# EAGLE design TOBD_STM32 (EAGLE 9.4.2)
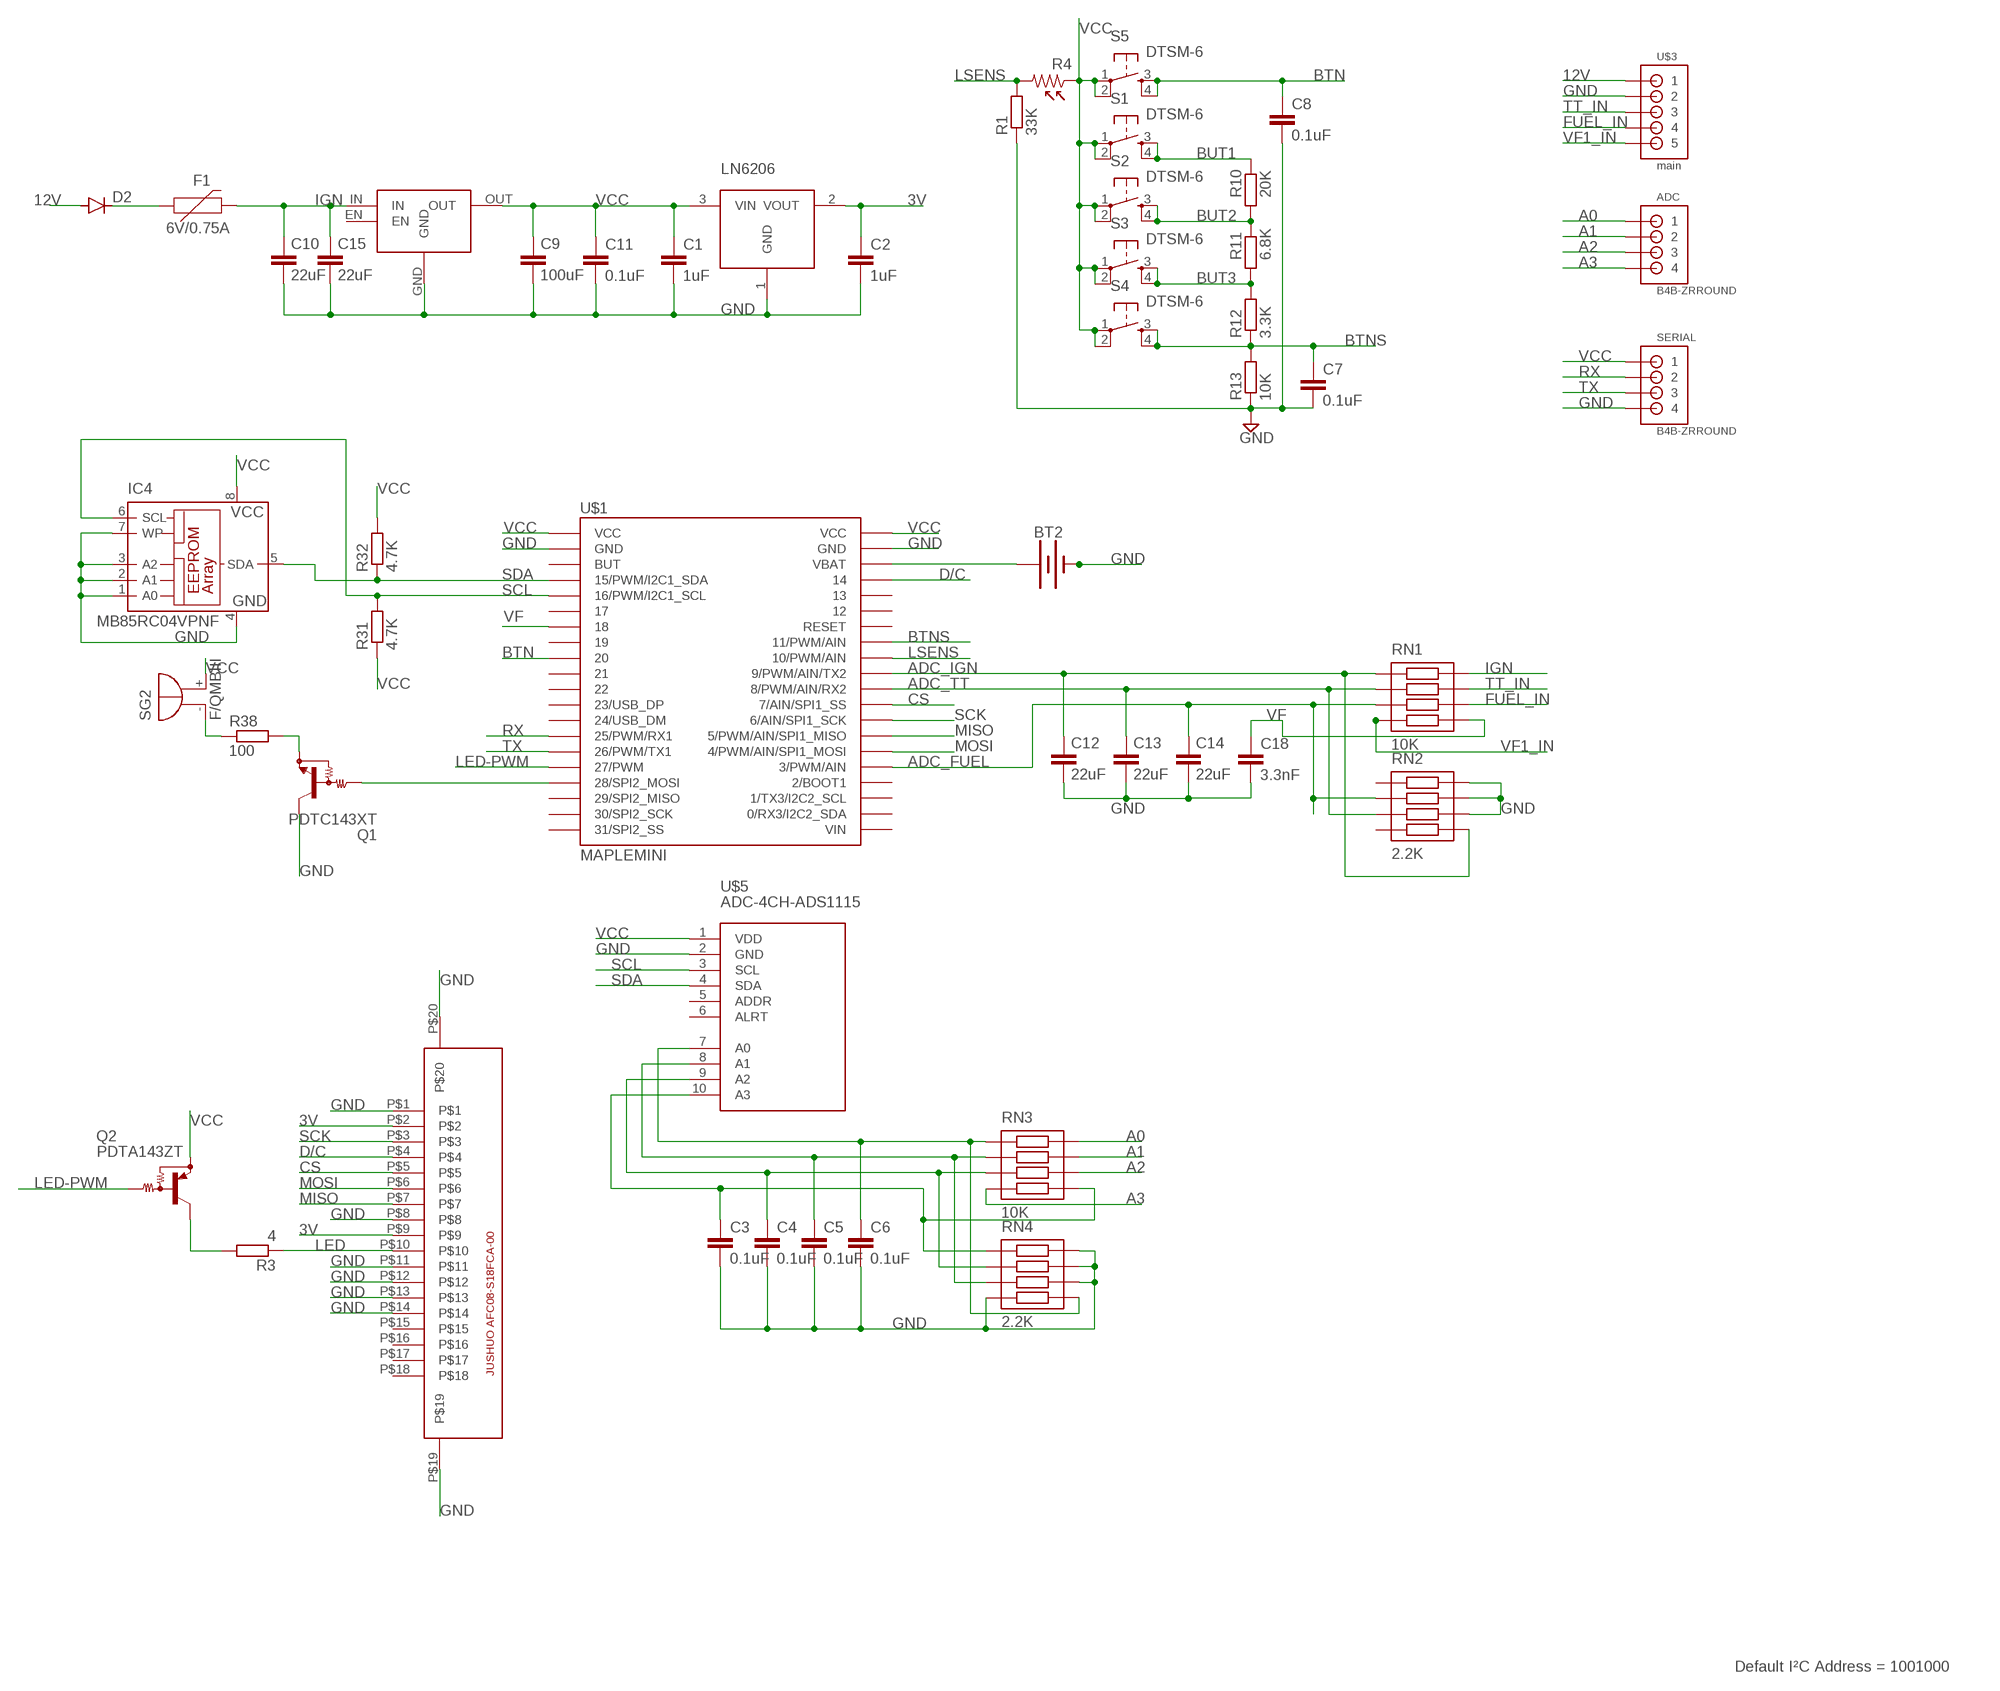
[diagram p0: schematic, sheet 1]

## Parts
ADC  B4B-ZRROUND  [B4B-ZR]
BT2  BATTERY  [BATTCOM_20MM_VERTICAL]
C1  1uF  C-EUC0805  [C0805]
C2  1uF  C-EUC0805  [C0805]
C3  0.1uF  C-EUC0805  [C0805]
C4  0.1uF  C-EUC0805  [C0805]
C5  0.1uF  C-EUC0805  [C0805]
C6  0.1uF  C-EUC0805  [C0805]
C7  0.1uF  C-EUC0805  [C0805]
C8  0.1uF  C-EUC0805  [C0805]
C9  100uF  C-EUC1210K  [C1210K]
C10  22uF  C-EUC0805  [C0805]
C11  0.1uF  C-EUC0805  [C0805]
C12  22uF  C-EUC0805  [C0805]
C13  22uF  C-EUC0805  [C0805]
C14  22uF  C-EUC0805  [C0805]
C15  22uF  C-EUC0805  [C0805]
C18  3.3nF  C-EUC0805  [C0805]
D2  DIODE-DO-214AC  [DO-214AC]
F1  6V/0.75A  PPTC_THREE-QUARTER-AMP  [1206]
IC4  MB85RC04VPNF  24C04ASN  [SO-08]
LN6206  MCP1700  [SOT23]
Q1  PDTC143XT  MUN2211T1  [SC59-BEC]
Q2  PDTA143ZT  MUN2111T1  [SC59-BEC]
R1  33K  R-EU_R0805  [R0805]
R3  4  R-EU_R0805  [R0805]
R4  PHOTORESPDV-P9  [PDV-P9XXX]
R10  20K  R-EU_R0805  [R0805]
R11  6.8K  R-EU_R0805  [R0805]
R12  3.3K  R-EU_R0805  [R0805]
R13  10K  R-EU_R0805  [R0805]
R31  4.7K  R-EU_R0805  [R0805]
R32  4.7K  R-EU_R0805  [R0805]
R38  100  R-EU_R0805  [R0805]
RN1  10K  RN2_EU-4  [CTS-744*083]
RN2  2.2K  RN2_EU-4  [CTS-744*083]
RN3  10K  RN2_EU-4  [CTS-744*083]
RN4  2.2K  RN2_EU-4  [CTS-744*083]
S1  DTSM-6  [DTSM-6]
S2  DTSM-6  [DTSM-6]
S3  DTSM-6  [DTSM-6]
S4  DTSM-6  [DTSM-6]
S5  DTSM-6  [DTSM-6]
SERIAL  B4B-ZRROUND  [B4B-ZR]
SG2  F/QMBIII  [F/QMBIII]
U$1  MAPLEMINI  [20-DIP]
U$2  JUSHUOAFC08-S18FCA-00  [JUSHUOAFC08-S18FCA-00]
U$3  main  B5B-ZRLONG  [B5B-ZR-LONG]
U$4  MINI-DC-DC-3AV  [MINI-DC-DC-3AV]
U$5  ADC-4CH-ADS1115  [ADC-4CH-ADS1115]

## Nets
3V: C2.1 LN6206.2(VOUT) U$2.P$2 U$2.P$9
12V: D2.A U$3.1
A0: ADC.1 RN3.5
A1: ADC.2 RN3.6
A2: ADC.3 RN3.7
A3: ADC.4 RN3.8
ADC_FUEL: C14.1 RN1.2 RN2.3 U$1.25(3/PWM/AIN)
ADC_IGN: C12.1 RN1.4 RN2.1 U$1.31(9/PWM/AIN/TX2)
ADC_TT: C13.1 RN1.3 RN2.2 U$1.30(8/PWM/AIN/RX2)
BTN: C8.1 S5.3 S5.4 U$1.9
BTNS: C7.1 R12.1 R13.2 S4.3 S4.4 U$1.33(11/PWM/AIN)
BUT1: R10.2 S1.3 S1.4
BUT2: R10.1 R11.2 S2.3 S2.4
BUT3: R11.1 R12.2 S3.3 S3.4
CS: U$1.29(7/AIN/SPI1_SS) U$2.P$5
D/C: U$1.37 U$2.P$4
FUEL_IN: RN1.7 U$3.4
GND: BT2.3(-) C1.2 C2.2 C3.2 C4.2 C5.2 C6.2 C7.2 C8.2 C9.2 C10.2 C11.2 C12.2 C13.2 C14.2 C15.2 C18.2 IC4.1(A0) IC4.2(A1) IC4.3(A2) IC4.4(GND) IC4.7(WP) LN6206.1(GND) Q1.C R1.1 R13.1 RN2.5 RN2.6 RN2.7 RN4.5 RN4.6 RN4.7 RN4.8 SERIAL.4 U$1.2(GND) U$1.39(GND) U$2.P$1 U$2.P$8 U$2.P$11 U$2.P$12 U$2.P$13 U$2.P$14 U$2.P$19 U$2.P$20 U$3.2 U$4.GND U$5.2(GND)
IGN: C10.1 C15.1 F1.2 RN1.5 U$4.IN
LED: R3.1 U$2.P$10
LED-PWM: Q2.B U$1.16(27/PWM)
LSENS: R1.2 R4.2 U$1.32(10/PWM/AIN)
MISO: U$1.27(5/PWM/AIN/SPI1_MISO) U$2.P$7
MOSI: U$1.26(4/PWM/AIN/SPI1_MOSI) U$2.P$6
N$1: R38.1 SG2.-(+)
N$2: Q2.C R3.2
N$3: D2.C F1.1
N$10: C6.1 RN3.4 RN4.1 U$5.7(A0)
N$11: C5.1 RN3.3 RN4.2 U$5.8(A1)
N$12: C4.1 RN3.2 RN4.3 U$5.9(A2)
N$13: C3.1 RN3.1 RN4.4 U$5.10(A3)
N$38: Q1.B U$1.17(28/SPI2_MOSI)
N$39: Q1.E R38.2
RX: SERIAL.2 U$1.14(25/PWM/RX1)
SCK: U$1.28(6/AIN/SPI1_SCK) U$2.P$3
SCL: IC4.6(SCL) R31.2 U$1.5(16/PWM/I2C1_SCL) U$5.3(SCL)
SDA: IC4.5(SDA) R32.1 U$1.4(15/PWM/I2C1_SDA) U$5.4(SDA)
TT_IN: RN1.6 U$3.3
TX: SERIAL.3 U$1.15(26/PWM/TX1)
VBAT1: BT2.1(+) BT2.2(+) U$1.38(VBAT)
VCC: C1.1 C9.1 C11.1 IC4.8(VCC) LN6206.3(VIN) Q2.E R4.1 R31.1 R32.2 S1.1 S1.2 S2.1 S2.2 S3.1 S3.2 S4.1 S4.2 S5.1 S5.2 SERIAL.1 SG2.+(-) U$1.1(VCC) U$1.40(VCC) U$4.OUT U$5.1(VDD)
VF: C18.1 RN1.1 U$1.7
VF1_IN: RN1.8 U$3.5
Unconnected: RN2.4 RN2.8 U$1.3(BUT) U$1.6 U$1.8 U$1.10 U$1.11 U$1.12(23/USB_DP) U$1.13(24/USB_DM) U$1.18(29/SPI2_MISO) U$1.19(30/SPI2_SCK) U$1.20(31/SPI2_SS) U$1.21(VIN) U$1.22(0/RX3/I2C2_SDA) U$1.23(1/TX3/I2C2_SCL) U$1.24(2/BOOT1) U$1.34(RESET) U$1.35 U$1.36 U$2.P$15 U$2.P$16 U$2.P$17 U$2.P$18 U$4.EN U$5.5(ADDR) U$5.6(ALRT)

## Notes on the sheet
- Default I²C Address = 1001000

## Library data of the parts
ADC SERIAL = jst:B4B-ZR: JST-ZH Connector 4 pol, 1.5mm pitch Package: B4B-ZR Source: http://www.jst-mfg.com/product/pdf/eng/eZH.pdf
BT2 = SparkFun-Batteries:BATTERY: Battery - Single Cell A variety of battery chemistries, sizes, and footprints. Device List: 20MM_PTH - Coin Cell Battery Holder - 20mm (PTH) <https://www.sparkfun.com/products/783> 6.8MM_PTH - Coin Cell Battery Holder - 6.8MM(SMD) <https://www.digikey.com/product-detail/en/seiko-instruments/MS621FE-FL11E/728-1057-ND/1889208?WT.srch=1&gclid=CNOQ5a6LzdQCFZS2wAodXCkE0g> 12MM_SMD - Coin Cell Battery Holder - 12mm (SMD) <https://www.sparkfun.com/products/10592> 12MM_PTH - Coin Cell Battery Holder - 12mm (PTH) <https://www.sparkfun.com/products/7948> 20MM_SMD - 20mm Coin Cell Battery Holder (SMD) (2 legs) Used on the Big Time Watch Kit <https://www.sparkfun.com/products/11734> 20MM_SMD_4LEGS - Coin Cell Battery Holder - 20mm (SMD) <https://www.sparkfun.com/products/11892> 20MM_SMD_4LEGS_OVERPASTE - Coin Cell Battery Holder - 20mm (SMD) <https://www.sparkfun.com/products/11892> (Over-paste on the legs) 24.5MM_PTH - Coin Cell Battery Holder - 24.5mm (PTH) <https://www.sparkfun.com/products/8863> 9V - 9V Battery Holder - PC Mount Used on the SparkFun SparkPunk Sound Kit <https://www.sparkfun.com/products/11177> and SparkFun SparkPunk Sequencer Kit <https://www.sparkfun.com/products/12707> 18650 - Battery Holder - 18650 (PTH) <https://www.sparkfun.com/products/13113> AA - Battery Holder - 1xAA (PTH) <https://www.sparkfun.com/products/7949> AAA - Battery Holder - 1xAAA (PTH) <https://www.sparkfun.com/products/12718> AA_KIT - Battery Holder - 1xAA (PTH) <https://www.sparkfun.com/products/7949> Special kit package - pads only have exposed copper on one side of the board. AAA_KIT - Battery Holder - 1xAAA (PTH) <https://www.sparkfun.com/products/12718> Special kit package - pads only have exposed copper on one side of the board.
C1 C2 = rcl:C-EU: CAPACITOR, European symbol; MF: Samsung Electro-Mechanics; MPN: CL21F105ZOFNNNE; SPICEPREFIX: C; URL: https://lcsc.com/product-detail/Multilayer-Ceramic-Capacitors-MLCC-SMD-SMT_SAMSUNG_CL21F105ZOFNNNE_1uF-105-80-20-16V_C16834.html
C3-C8 C11 = rcl:C-EU: CAPACITOR, European symbol; MF: Samsung Electro-Mechanics; MPN: CL21F104ZBCNNNC; SPICEPREFIX: C; URL: https://lcsc.com/product-detail/Multilayer-Ceramic-Capacitors-MLCC-SMD-SMT_SAMSUNG_CL21F104ZBCNNNC_100nF-104-80-20-50V_C1760.html
C9 = resistor:C-EU: CAPACITOR, European symbol; LCSC: C88154; MF: Murata Electronics; MPN: GRM32ER60J107ME20L; URL: https://lcsc.com/product-detail/Multilayer-Ceramic-Capacitors-MLCC-SMD-SMT_muRata_GRM32ER60J107ME20L_100uF-107-20-6-3V_C88154.html
C10 C12-C15 = resistor:C-EU: CAPACITOR, European symbol; LCSC: C45783; MF: Samsung Electro-Mechanics; MPN: CL21A226MAQNNNE; URL: https://lcsc.com/product-detail/Multilayer-Ceramic-Capacitors-MLCC-SMD-SMT_Samsung-Electro-Mechanics-CL21A226MAQNNNE_C45783.html
C18 = rcl:C-EU: CAPACITOR, European symbol; MPN: CL21B332KBANNNC; SPICEPREFIX: C
D2 = diode:DIODE-: DIODE
F1 = SparkFun-Fuses:PPTC: Resettable Fuse PPTC Resettable Fuse. Really a sort of resistor with a polymeric positive temperature coefficient whose resistance increases dramatically with an increase in temperature. When heated by the power passing through the resistance rises causing the current to be limited, protecting the circuit. This is achieved by the transition of the polymer from a crystalline to an amorphous state where the conductive carbon separates breaking the conductive pathways found in the cool crystalline structure. When a PPTC cools back down it resumes conducting letting the circuit turn back on. SparkFun Products: SparkFun RedBoard - Programmed with Arduino <https://www.sparkfun.com/products/12757> Pro Micro - 5V/16MHz <https://www.sparkfun.com/products/12640> Arduino Pro 328 - 5V/16MHz <https://www.sparkfun.com/products/10915> MP3 Trigger <https://www.sparkfun.com/products/13720>; PROD_ID: RES-11150
IC4 = microchip:24C*: Serial EEPROM 1 K/2 K/4 K; OC_FARNELL: unknown; OC_NEWARK: unknown
LN6206 = borkedlabs-powerics:MCP1700; MPN: LN6206P302MR-G
Q1 = transistor-npn:MUN2211*: NPN Bias Resistor Transistor
Q2 = transistor-pnp:MUN2111*: PNP Bias Resistor Transistor
R1 R3 R10-R13 R31 R32 R38 = resistor:R-EU_: RESISTOR, European symbol
R4 = my_mixed:PHOTORES: Photoresistor
RN1-RN4 = m-pad-2.1:RN2_EU: Chip Resistor Array's from various manufactures; MPN: CRA064RJ10K0E04Z
S1-S5 = switch-tact:DTSM-6
SG2 = buzzer:F/QMBIII: BUZZER Source: Buerklin; OC_FARNELL: unknown; OC_NEWARK: unknown
U$1 = maplemini:MAPLEMINI
U$2 = my:JUSHUOAFC08-S18FCA-00; MPN: AFC08-S18FCA-00
U$3 = jst:B5B-ZR: JST-ZH Connector 5 pol, 1.5mm pitch Package: B5B-ZR Source: http://www.jst-mfg.com/product/pdf/eng/eZH.pdf
U$4 = my:MINI-DC-DC-3A
U$5 = diy-modules:ADC-4CH-ADS1115: 4 Channel 16-Bit Analog-to-Digital Converter based on ADS1115 chip Arduino ADS1115 Getting Started Tutorial is available here: http://henrysbench.capnfatz.com/henrys-bench/arduino-voltage-measurements/arduino-ads1115-module-getting-started-tutorial/ ADS1115 datasheet is available here: http://www.ti.com/lit/ds/symlink/ads1115.pdf Click here to find device on ebay.com <http://www.ebay.com/sch/ads1115+module>

## Board
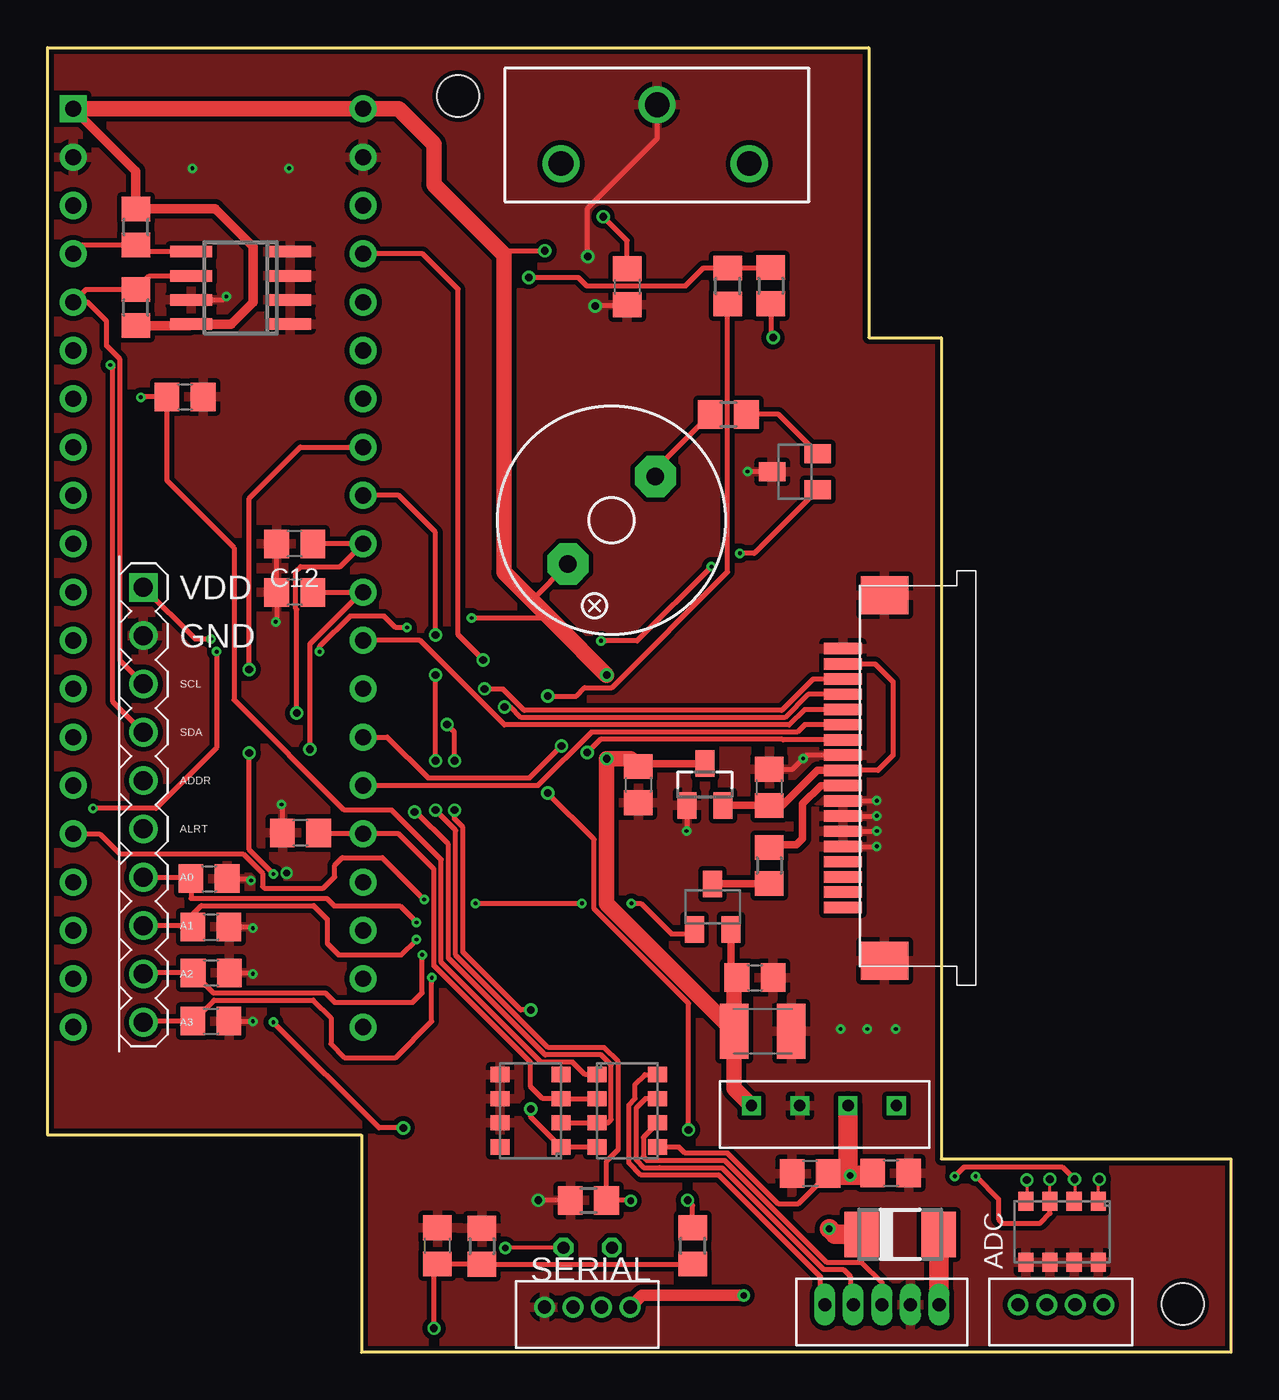
[diagram p1: board, top side]
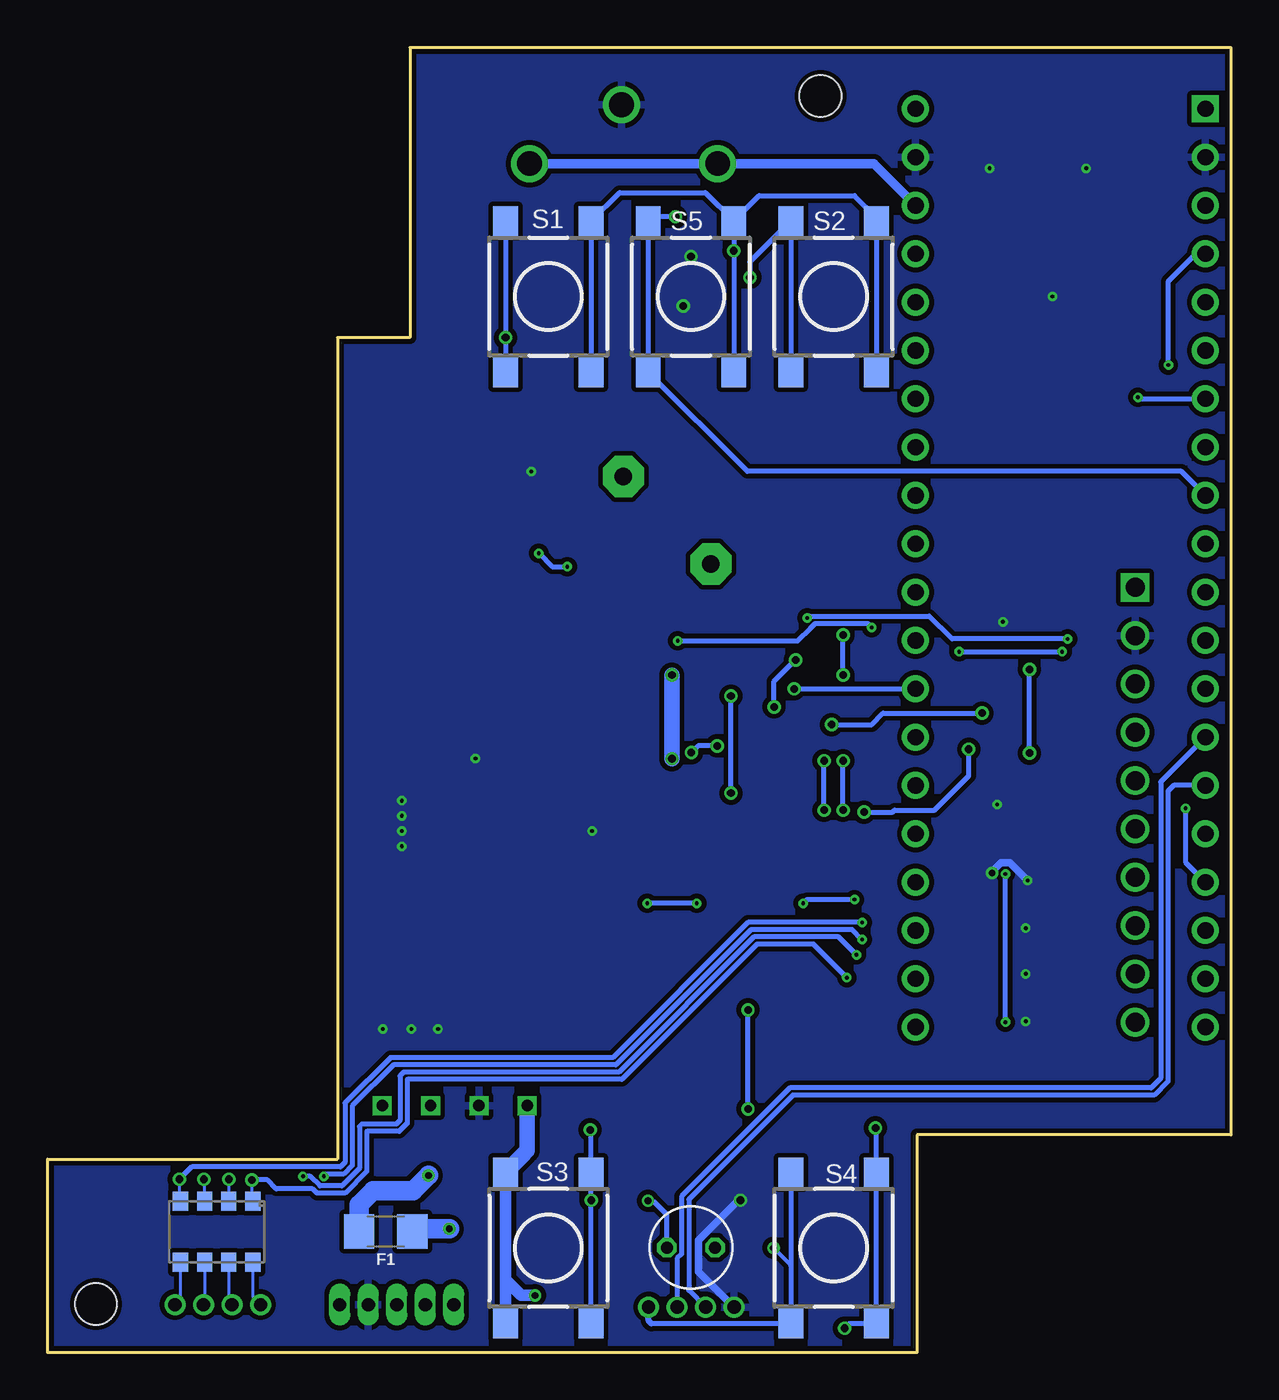
[diagram p2: board, bottom side, seen from below]

Size 62.23 x 68.58 mm. Coordinates in mm from the lower left corner, seen from the top.
Outline: 43.18,68.58 43.18,53.34 46.99,53.34 46.99,10.16 62.23,10.16 62.23,0 16.51,0 16.51,11.43 0,11.43 0,68.58 43.18,68.58
Copper layers (1*16): Top 0.035mm / dielectric 1.5mm / Bottom 0.035mm
Design rules "jlcpcb": minimum track width 5mil, minimum drill 0.2mm, track to track 5mil, track to pad 5mil, pad to pad 5mil, via to via 5mil, smd to smd 5mil, copper to edge 0.2mm, drill to drill 6mil, minimum pad ring 0.2mm, minimum via ring 0.15mm, stop-mask expansion 4mil, vias tented up to drill 0mil, thermal gap 10mil
Holes 2.2 mm at 21.59,66.04 59.69,2.54

### Footprints (pad centres in the part's own frame; a part is rotated, then mirrored left to right if it is on the bottom)
B4B-ZR = drill 0.7: 1 6,-1.3; 2 4.5,-1.3; 3 3,-1.3; 4 1.5,-1.3
BATTCOM_20MM_VERTICAL = drill 1.3: 1 4.85,-2; 2 -5.04,-2; 3 0.01,1.1
C0805 = smd 1.3 x 1.5: 1 -0.95,0; 2 0.95,0
C1210K = smd 1.5 x 2.9: 1 -1.5,0; 2 1.5,0
DO-214AC = smd 1.8 x 2.4: A 2.025,0; C -2.025,0
1206 = smd 1.6 x 1.8: 1 -1.4,0; 2 1.4,0
SO-08 = smd 0.6 x 2.2: 1 -1.905,-2.6; 2 -0.635,-2.6; 3 0.635,-2.6; 4 1.905,-2.6; 5 1.905,2.6; 6 0.635,2.6; 7 -0.635,2.6; 8 -1.905,2.6
SOT23 = smd 1 x 1.4: 1 -0.95,-1.1; 2 0.95,-1.1; 3 0,1.1
SC59-BEC = smd 1 x 1.4: B -0.95,-1.2; C 0,1.2; E 0.95,-1.2
R0805 = smd 1.3 x 1.5: 1 -0.95,0; 2 0.95,0
PDV-P9XXX = drill 0.635 octagon: 1 -1.27,0; 2 1.27,0
CTS-744*083 = smd 0.8 x 1: 1 -1.905,-1.6; 2 -0.635,-1.6; 3 0.635,-1.6; 4 1.905,-1.6; 5 1.905,1.6; 6 0.635,1.6; 7 -0.635,1.6; 8 -1.905,1.6
DTSM-6 = smd 1.55 x 1.3: 1 -3.975,2.25; 2 3.975,2.25; 3 -3.975,-2.25; 4 3.975,-2.25
F/QMBIII = drill 0.914 pad 2.159 octagon: + 3.251,0; - -3.251,0
20-DIP = drill 0.85 pad 1.422 square: 1 -24.13,-7.62 | drill 0.85 pad 1.422: 2 -21.59,-7.62; 3 -19.05,-7.62; 4 -16.51,-7.62; 5 -13.97,-7.62; 6 -11.43,-7.62; 7 -8.89,-7.62; 8 -6.35,-7.62; 9 -3.81,-7.62; 10 -1.27,-7.62; 11 1.27,-7.62; 12 3.81,-7.62; 13 6.35,-7.62; 14 8.89,-7.62; 15 11.43,-7.62; 16 13.97,-7.62; 17 16.51,-7.62; 18 19.05,-7.62; 19 21.59,-7.62; 20 24.13,-7.62; 21 24.13,7.62; 22 21.59,7.62; 23 19.05,7.62; 24 16.51,7.62; 25 13.97,7.62; 26 11.43,7.62; 27 8.89,7.62; 28 6.35,7.62; 29 3.81,7.62; 30 1.27,7.62; 31 -1.27,7.62; 32 -3.81,7.62; 33 -6.35,7.62; 34 -8.89,7.62; 35 -11.43,7.62; 36 -13.97,7.62; 37 -16.51,7.62; 38 -19.05,7.62; 39 -21.59,7.62; 40 -24.13,7.62
JUSHUOAFC08-S18FCA-00 = smd 0.6 x 2: P$1 0.3,1; P$2 1.1,1; P$3 1.9,1; P$4 2.7,1; P$5 3.5,1; P$6 4.3,1; P$7 5.1,1; P$8 5.9,1; P$9 6.7,1; P$10 7.5,1; P$11 8.3,1; P$12 9.1,1; P$13 9.9,1; P$14 10.7,1; P$15 11.5,1; P$16 12.3,1; P$17 13.1,1; P$18 13.9,1 | smd 2 x 2.5: P$19 -2.5,3.2; P$20 16.7,3.2
B5B-ZR-LONG = drill 0.7 long: 1 7.5,-1.3; 2 6,-1.3; 3 4.5,-1.3; 4 3,-1.3; 5 1.5,-1.3
MINI-DC-DC-3AV = drill 0.6 square: EN 1.27,9.271; GND 1.27,4.191; IN 1.27,6.731; OUT 1.27,1.651
ADC-4CH-ADS1115 = drill 1 square: 1 1.27,24.384 | drill 1: 2 1.27,21.844; 3 1.27,19.304; 4 1.27,16.764; 5 1.27,14.224; 6 1.27,11.684; 7 1.27,9.144; 8 1.27,6.604; 9 1.27,4.064; 10 1.27,1.524

### Placement (x,y rotation side)
ADC  49.53,3.81 0 top
BT2  32.04,64.48 0 top
C1  31.06,29.84 270 top
C2  37.95,29.7 90 top
C3  8.59,17.41 0 top
C4  8.61,19.95 0 top
C5  8.59,22.36 0 top
C6  8.49,24.9 0 top
C7  20.5,5.6 90 top
C8  30.47,56.01 270 top
C9  37.6,16.88 0 top
C10  40.1,9.4 180 top
C11  37.2,19.7 0 top
C12  13,42.5 180 top
C13  13,39.95 180 top
C14  13.3,27.3 180 top
C15  44.33,9.43 0 top
C18  7.23,50.22 0 top
D2  44.83,6.2 0 top
F1  44.45,6.35 180 bottom
IC4  10.15,55.95 90 top
LN6206  34.56,29.85 0 top
Q1  39.3,46.29 90 top
Q2  34.97,23.42 0 top
R1  28.44,7.99 0 top
R3  37.95,25.59 270 top
R4  28.4,5.51 180 bottom
R10  38.03,56.07 270 top
R11  35.76,56.05 90 top
R12  33.92,5.6 90 top
R13  22.84,5.58 270 top
R31  4.64,54.92 90 top
R32  4.64,59.15 90 top
R38  35.79,49.3 0 top
RN1  30.48,12.7 270 top
RN2  25.4,12.7 90 top
RN3  53.34,6.35 180 bottom
RN4  53.34,6.35 180 top
S1  35.9,55.49 270 bottom
S2  20.9,55.49 270 bottom
S3  35.9,5.49 90 bottom
S4  20.9,5.49 90 bottom
S5  28.4,55.49 270 bottom
SERIAL  24.63,3.68 0 top
SG2  29.66,43.74 225 top
U$1  8.97,41.23 270 top
U$2  40.81,37.29 270 top
U$3  39.37,3.81 0 top
U$4  35.36,14.24 270 top
U$5  3.77,15.83 0 top

### Tracks (layer width: path | path; a pad name or v marks a point on that pad's centre or on a via)
3V
  Top 0.254: U$2.P$2 43.51,36.19 44.45,35.25 44.45,31.38 43.66,30.59 U$2.P$9
  Top 0.406: U$2.P$9 40.47,30.59 38.63,28.75 C2.1 LN6206.2
12V
  Top 1.016: U$3.1 46.87,6.18 D2.A
A0
  Bottom 0.152: RN3.5 55.24,2.79 ADC.1
A1
  Bottom 0.152: RN3.6 53.98,2.56 ADC.2
A2
  Bottom 0.152: RN3.7 52.7,2.69 ADC.3
A3
  Bottom 0.152: RN3.8 51.44,2.92 ADC.4
ADC_FUEL
  Top 0.254: C14.1 14.29,27.26 U$1.25 18.46,27.26 20.32,25.4 20.32,20.32 25.4,15.24 25.4,13.97 26.04,13.34 RN2.3 RN1.2
ADC_IGN  (via drill 0.4)
  Top 0.254: RN1.4 RN2.1 25.4,12.39 v25.4,12.8 | C12.1 U$1.31 15.39,41.3 13.3,41.3 13.05,41.05 13.05,39.09 13.1,39.04 v13.1,33.6 | v25.4,18 24.88,18 21.84,21.03 21.84,27.59 21.4,28.04 v21.4,28.5 | v21.4,31.1 21.4,32.6 v21,33
  Bottom 0.254: v25.4,12.8 v25.4,18 | v21.4,28.5 v21.4,31.1 | v21,33 18.9,33 18.3,33.6 v13.1,33.6
ADC_TT  (via drill 0.4)
  Top 0.254: RN2.2 RN1.3 29.46,12.06 29.63,12.23 29.63,15.11 29.1,15.64 26.16,15.64 21.08,20.72 21.08,26.7 19.38,28.4 v19.3,28.4 | C13.1 16.51,39.95 | 16.51,39.95 U$1.30 | v13.8,31.7 13.8,37.24 16.51,39.95
  Bottom 0.254: v19.3,28.4 17.8,28.4 17.7,28.5 15.6,28.5 13.8,30.3 v13.8,31.7
BTN  (via drill 0.4)
  Top 0.254: C8.1 30.47,58.43 v29.21,59.69
  Bottom 0.254: v29.21,59.69 30.43,59.69 S5.3 S5.4 25.43,46.3 2.61,46.3 U$1.9
BTNS  (via drill 0.2, 0.4)
  Top 0.254: v20.32,1.27 20.32,4.47 C7.1 22.82,4.65 R13.2 33.9,4.63 R12.1 | v18.7,11.8 17.43,11.8 v11.87,17.36 | v10.6,35.9 10.6,44.89 13.29,47.58 U$1.33 | v11.87,25.15 10.6,26.42 v10.6,31.5
  Bottom 0.254: v20.32,1.27 20.07,1.51 S4.3 S4.4 18.65,11.75 v18.7,11.8 | v10.6,31.5 v10.6,35.9 | v11.87,17.36 v11.87,25.15
BUT1  (via drill 0.4)
  Top 0.254: R10.2 38.03,53.46 v38.15,53.34
  Bottom 0.254: S1.3 v38.15,53.34 S1.4
BUT2  (via drill 0.4)
  Top 0.254: R10.1 38.01,57 R11.2 34.49,57 33.55,56.06 28.34,56.06 27.9,56.5 v25.3,56.5
  Bottom 0.254: S2.4 S2.3 25.3,57.31 v25.3,56.5
BUT3  (via drill 0.4)
  Top 0.254: R12.2 33.92,7.73 v33.65,8 | v26.3,29.4 28.74,26.96 28.74,23.31 33.7,18.35 v33.7,11.7 | v26.3,34.5 27.8,34.5 28.24,34.94 29.67,34.94 35.76,41.03 R11.1
  Bottom 0.254: S3.3 v33.65,8 S3.4 33.65,11.65 v33.7,11.7 | v26.3,29.4 v26.3,34.5
CS
  Top 0.254: U$2.P$5 39.81,33.79 39,32.98 24.02,32.98 19.58,37.42 U$1.29
D/C  (via drill 0.4)
  Top 0.254: U$2.P$4 39.99,34.59 38.76,33.36 24.91,33.36 24.34,33.93 v24.03,33.93 | v22.9,36.4 21.59,37.71 21.59,55.88 19.73,57.74 U$1.37
  Bottom 0.254: v24.03,33.93 24.03,35.27 v22.9,36.4
FUEL_IN
  Top 0.254: U$3.4 42.2,2.68 42.2,4 41.84,4.37 40.8,4.37 35.46,9.7 32.2,9.7 32.18,9.72 31.34,9.72 30.95,10.12 30.95,12.85 31.43,13.34 RN1.7
GND  (via drill 0.2, 0.35, 0.4)
  Top 0.254: R1.1 v25.81,7.99 v25.8,8 | C8.2 30.41,55 v28.8,55 | BT2.3 32.05,63.79 28.4,60.14 v28.4,57.6 | v12,38.4 12.05,38.45 C13.2 C12.2 | C14.2 12.35,28.75 v12.3,28.8 | LN6206.1 v33.61,27.41 v33.6,27.4 | C2.2 39.16,30.65 v39.73,31.22 39.9,31.39 U$2.P$8 | C6.2 10.6,24.9 v10.7,24.8 | C5.2 10.74,22.36 v10.8,22.3 | C4.2 10.75,19.95 v10.8,19.9 | C3.2 v10.79,17.41 v10.8,17.4 | IC4.7 9.21,55.31 v9.4,55.5 | U$2.P$11 v43.59,28.99 v43.6,29 | U$2.P$12 v43.6,28.19 v43.6,28.2 | U$2.P$13 v43.59,27.39 v43.6,27.4 | U$2.P$14 v43.59,26.59 v43.6,26.6 | Q1.C v36.81,46.29 v36.8,46.3
  Bottom 0.406: SERIAL.4 27.99,4.24 27.99,5.9 25.89,8 v25.8,8 | 11.29,25.39 11.63,25.73 12.11,25.73 12.45,25.39 12.45,25.32 v12.57,25.2 | 11.29,25.39 | v10.7,24.8 11.29,25.39
  other vias: 41.7,17 43.1,17 44.6,17 7.62,62.23 12.7,62.23
  pour Bottom (isolate 0.254): -2.54,69.85 63.5,69.85 63.5,-2.54 -2.54,-2.54
  pour Top (isolate 0.254): -2.54,69.85 63.5,69.85 63.5,-5.08 -2.54,-5.08
IGN  (via drill 0.35)
  Top 0.254: C10.1 39.45,7.8 38.44,7.8 35.76,10.48 33.52,10.48 33.2,10.79 RN1.5
  Top 1.016: 43.18,9.23 C15.1 43.25,9.3 v42.2,9.3 41.81,9.3 41.91,9.4 | C10.1 41.91,9.4 | U$4.IN 42.09,9.58 41.91,9.4
  Bottom 1.016: F1.2 45.85,7.75 45.1,8.5 43,8.5 v42.2,9.3
LED
  Top 0.406: U$2.P$10 40.66,29.79 39.7,28.83 39.7,27 39.37,26.67 38.08,26.67 R3.1
LED-PWM  (via drill 0.2)
  Top 0.254: U$1.16 2.74,27.26 3.8,26.2 10.28,26.2 11.3,25.18 11.3,24.5 11.4,24.4 14.5,24.4 15.1,25 15.1,25.6 15.5,26 17.6,26 v19.8,23.8 | v22.5,23.6 v28.1,23.6 | v30.7,23.6 31.2,23.6 32.8,22 33.8,22 Q2.B
  Bottom 0.254: v19.8,23.8 22.3,23.8 v22.5,23.6 | v28.1,23.6 v30.7,23.6
LSENS  (via drill 0.35, 0.4)
  Top 0.254: v30.66,7.97 30.65,7.99 R1.2 29.39,10.05 30.02,10.67 30.02,15.27 29.26,16.02 26.32,16.02 21.46,20.88 21.46,27.44 v20.4,28.5 | v20.4,31.1 v20.4,35.6 | v20.4,37.7 20.4,43.1 18.46,45.04 U$1.32
  Bottom 0.254: v30.66,7.97 30.4,7.97 29.67,7.24 R4.2 | v20.4,28.5 v20.4,31.1 | v20.4,35.6 v20.4,37.7
MISO  (via drill 0.4)
  Top 0.254: U$1.27 17.86,32.34 20,30.2 25.35,30.2 v27.02,31.88 | v28.38,31.52 29.07,32.22 38.64,32.22 38.67,32.19 U$2.P$7
  Bottom 0.254: v27.02,31.88 28.02,31.88 v28.38,31.52
MOSI
  Top 0.254: U$1.26 25.8,29.8 28.6,32.6 39.42,32.6 39.81,32.99 U$2.P$6
N$1
  Top 0.254: R38.1 31.95,46.41 SG2.-
N$2
  Top 0.406: Q2.C 34.99,24.64 R3.2
N$3  (via drill 0.35)
  Top 1.016: D2.C 41.4,6.2 v41.1,6.5
  Bottom 1.016: v41.1,6.5 42.9,6.5 F1.1
N$10  (via drill 0.2, 0.4)
  Top 0.152: RN4.1 55.24,9.04 v55.3,9.1
  Top 0.254: U$5.7 7.47,24.97 C6.1 7.54,23.86 14.68,23.86 15.07,23.47 18.53,23.47 v19.4,22.6
  Bottom 0.152: v55.3,9.1 55.3,8.01 RN4.1
  Bottom 0.254: v19.4,22.6 25.4,22.6 32.5,15.5 44.2,15.5 46.59,13.11 46.59,9.99 46.82,9.76 54.64,9.76 v55.3,9.1
N$11  (via drill 0.2, 0.4)
  Top 0.152: v54,9.1 54,7.97 RN4.2
  Top 0.254: U$5.8 7.57,22.43 C5.1 7.64,23.04 8.08,23.48 14,23.48 14.7,22.78 14.7,21.5 15.3,20.9 18.6,20.9 v19.4,21.7 | v47.7,9.25 48.2,9.76 53.34,9.76 v54,9.1
  Bottom 0.152: RN4.2 53.98,9.07 v54,9.1
  Bottom 0.254: v19.4,21.7 19.92,22.22 25.24,22.22 32.34,15.12 44.04,15.12 46.21,12.96 46.21,9.84 46.66,9.38 47.58,9.38 v47.7,9.25
N$12  (via drill 0.2, 0.4)
  Top 0.152: RN4.3 52.7,8.89 52.7,8.9 v52.7,9.1
  Top 0.254: U$5.9 5.1,19.95 C4.1 8.71,18.9 14.6,18.9 15.1,18.4 19.2,18.4 19.7,18.9 v19.7,20.9 | v48.8,9.25 50,8.05 50,7 50.2,6.8 52.2,6.8 52.7,7.3 RN4.3
  Bottom 0.152: v52.7,9.1 RN4.3
  Bottom 0.254: v19.7,20.9 20.64,21.84 25.08,21.84 32.18,14.74 43.5,14.74 43.7,14.54 43.7,12.2 43.9,12 45.7,12 45.83,11.88 45.83,9.68 46.75,8.75 47.91,8.75 48.41,9.25 v48.8,9.25
N$13  (via drill 0.2, 0.4)
  Top 0.152: v51.49,9.07 51.49,8.01 RN4.4
  Top 0.254: U$5.10 5.1,17.41 C3.1 8.75,18.52 13.97,18.52 14.9,17.59 14.9,16.2 15.6,15.5 18.3,15.5 20.2,17.4 v20.2,19.7
  Bottom 0.152: v51.49,9.07 51.49,8.01 RN4.4
  Bottom 0.254: v20.2,19.7 21.96,21.46 24.93,21.46 32.03,14.36 43.3,14.36 43.32,14.34 43.32,12.04 43.74,11.62 45.42,11.62 45.44,11.6 45.44,9.52 46.6,8.37 48.07,8.37 48.3,8.6 50.2,8.6 50.67,9.07 v51.49,9.07
N$38  (via drill 0.2)
  Top 0.254: Q1.B 37.16,42 v36.4,42 | v34.9,41.3 31,37.4 v29.1,37.4 | v18.9,38.1 18.3,38.1 17.7,38.7 15.9,38.7 14.3,37.1 v14.3,36.83 | v8.89,36.83 8.89,31.79 5.7,28.6 v2.4,28.6
  Bottom 0.254: v36.4,42 35.7,41.3 v34.9,41.3 | v29.1,37.4 22.8,37.4 22.1,38.1 22.09,38.1 21.86,38.32 19.12,38.32 v18.9,38.1 | v14.3,36.83 v8.89,36.83 | v2.4,28.6 2.4,25.77 U$1.17
N$39
  Top 0.254: Q1.E 38.44,49.3 R38.2
RX
  Bottom 0.254: U$1.14 3.7,29.99 3.7,14.4 4.2,13.9 23.2,13.9 28.9,8.2 28.9,5.17 29.13,4.94 SERIAL.2
SCK  (via drill 0.4)
  Top 0.254: U$2.P$3 40.25,35.39 38.6,33.74 25.07,33.74 23.93,34.88 v22.98,34.88
  Bottom 0.254: v22.98,34.88 U$1.28
SCL
  Top 0.254: IC4.6 5.36,56.59 R31.2 2.02,55.87 U$1.5 2.1,55.2 3.1,54.2 3.1,52.9 3.81,52.19 3.81,36.36 U$5.3
SDA  (via drill 0.2)
  Top 0.254: IC4.5 4.99,57.85 R32.1 1.81,58.2 U$1.4 | U$5.4 3.43,34.2 3.43,51.77 v3.3,51.9
  Bottom 0.254: v3.3,51.9 3.3,56.3 1.86,57.74 U$1.4
TT_IN
  Top 0.254: RN1.6 31.33,11.3 31.33,10.29 31.5,10.12 31.5,10.1 35.6,10.1 40.95,4.75 42.8,4.75 43.87,3.68 U$3.3
TX
  Bottom 0.254: U$1.15 3.02,29.8 3.32,29.5 3.32,14.24 4.04,13.52 23.04,13.52 28.52,8.04 28.52,3.27 SERIAL.3
VBAT1
  Bottom 0.508: U$1.38 18.79,62.48 BT2.2 BT2.1
VCC  (via drill 0.2, 0.35, 0.4)
  Top 0.203: R4.1 v24.06,5.49
  Top 0.254: Q2.E 35.92,17.06 C9.1 36.1,16.51 | 24,57.7 24.2,57.9 v26.15,57.9 | U$5.1 7.75,37.5 v8.6,37.5 | v22.29,38.6 26.4,38.6 26.79,38.22 | 25.52,39.48 25.52,39.6 SG2.+
  Top 0.406: C11.1 35.92,20.03 Q2.E | LN6206.3 31.22,30.95 C1.1
  Top 0.508: U$1.1 4.64,62.07 R32.2 8.8,60.1 10.8,58.1 10.8,55.2 9.64,54.05 IC4.8 7.47,53.97 R31.1
  Top 0.61: v36.6,3 31.25,3 SERIAL.1
  Top 0.813: U$4.OUT 36.1,13.88 36.1,16.51 | C11.1 36.1,19.55 C9.1 29.4,23.58 v29.4,31.2 30.65,31.2 C1.1 | v29.4,35.6 26.79,38.22 25.52,39.48 24,41 24,57.7 20.32,61.38 20.32,63.5 18.46,65.36 U$1.40 U$1.1
  Bottom 0.203: 23.15,4.58 v24.06,5.49
  Bottom 0.254: S4.2 23.15,4.58 S4.1 30.48,1.51 | S2.2 S2.1 18.65,59.65 19.8,60.8 24.82,60.8 S5.1 | S5.1 v26.15,57.9 S5.2 | S1.2 S1.1 32.16,60.96 27.64,60.96 S5.1 | 37.01,10.6 37.14,10.47 | v22.29,38.6 22.19,38.7 15.88,38.7 14.68,37.5 v8.6,37.5
  Bottom 0.305: 30.48,1.51 30.63,1.67 SERIAL.1
  Bottom 0.61: S3.2 38.15,3.81 | 38.15,3.81 S3.1 | 38.15,3.81 37.34,3 v36.6,3
  Bottom 0.813: v29.4,31.2 v29.4,35.6 | U$4.OUT 37.01,10.6 | 37.14,10.47 S3.2
VF  (via drill 0.2)
  Top 0.254: RN1.1 28.26,14.61 27.61,15.26 25.94,15.26 20.7,20.5 20.7,25.9 18.1,28.5 15.6,28.5 9.81,34.29 9.81,42.29 6.28,45.82 C18.1 4.92,50.22 v4.9,50.2
  Bottom 0.254: v4.9,50.2 4.82,50.12 U$1.7
VF1_IN
  Top 0.254: U$3.5 40.64,2.74 40.64,3.98 35.3,9.32 31.2,9.32 30.56,9.96 30.56,13 30.9,13.34 30.9,14.1 31.41,14.61 RN1.8